# Altium schematic sheet J2_RefClkAndRTC.SchDoc
size A4; Organization: UltraZohm; SheetNumber: 5
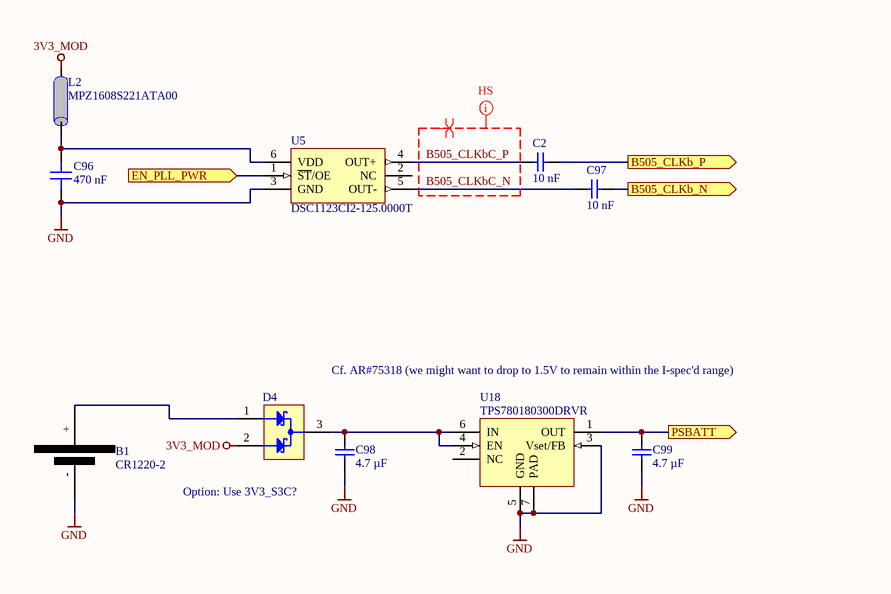
[diagram p0: J2_RefClkAndRTC.SchDoc]

## Parts
B1  CR1220-2  [CR1220]
C2  10 nF  [C_0402_TE]
C96  470 nF  [C_0603_TE]
C97  10 nF  [C_0402_TE]
C98  4.7 µF  [C_0603_TE]
C99  4.7 µF  [C_0603_TE]
D4  BAT54CT-7-F  [SOT523-3]  (value not drawn)
L2  MPZ1608S221ATA00  [RES 0603_1608]
U5  DSC1123CI2-125.0000T  [PSON105P320X250X90-6N]
U18  TPS780180300DRVR  [SON65P200X200X80-7N]

## Ports
B505_CLKb_N (out), B505_CLKb_P (out), EN_PLL_PWR (in), PSBATT (out)

## Nets
3V3_MOD: D4.2(A) L2.1
GND: B1.- C96.1 C98.1 C99.1 U5.3(GND) U18.3(Vset/FB) U18.5(GND) U18.7(PAD)
B505_CLKb_N: C97.2 ; port B505_CLKb_N
B505_CLKb_P: C2.2 ; port B505_CLKb_P
B505_CLKbC_N: C97.1 U5.5(OUT-)
B505_CLKbC_P: C2.1 U5.4(OUT+)
EN_PLL_PWR: U5.1(~{ST}/OE) ; port EN_PLL_PWR
PSBATT: C99.2 U18.1(OUT) ; port PSBATT
NetB1_+: B1.+ D4.1(A)
NetC96_2: C96.2 L2.2 U5.6(VDD)
NetC98_2: C98.2 D4.3(K) U18.4(EN) U18.6(IN)

Not connected (* = marked no-connect by the designer): U5 2(NC); U18 2(NC)

## Layout directives
differential pair: B505_CLKbC_N, B505_CLKbC_P
net class HS: B505_CLKbC_N, B505_CLKbC_P

## Notes on the sheet
- Cf. AR#75318 (we might want to drop to 1.5V to remain within the I-spec'd range)
- Option: Use 3V3_S3C?
- Title
- Revision:
- Design Engineer:
- Date:
- Project:
- Sheet
- of

## Library data of the parts
B1 = CR1220-2: Battery base CR1220 SMD Button And Strip Battery Connector ROHS; Manufacturer: Q&J; Created from: FRosner; Manufacturer Part Number: CR1220-2; PartID: 36; Created On: 02/07/2024 19:17:25; ComponentLink1Description: Datasheet; ComponentLink1URL: https://wmsc.lcsc.com/wmsc/upload/file/pdf/v2/lcsc/2405081637_Q-J-CR1220-2_C70381.pdf; Component Type: Battery holder; Device Package: SMD; Last Updated: 23/08/2024 11:42:29; Mounting Type: SMD; Operating Temperature: -40 to +85 °C; Supplier 1: LCSC; Supplier Part Number 1: C70381; Type: Battery holder; Live Cycle Status: 1; LCSC Part Number: C70381; Stock number: not stored
C2 C97 = UZgen_C_0402_10nF_16V_X7R: Generic capacitor; Manufacturer: UZgen; Voltage: 16V; Tolerance: 10 %; Created from: UZgenTool; Technology: X7R; Value: 10 nF; Manufacturer Part Number: UZgen_C_0402_10nF_16V_X7R; PartID: 2900; Created On: 02/08/2024 11:17:39; Device Package: 0402; Mounting Type: SMD; Last Updated: 02/08/2024 11:17:39
C96 = CL10A474KB8NNNC: Capacitor 0603, 50 VDC, 470 nF, X5R; Manufacturer: Samsung Electro-Mechanics; Tolerance: 10 %; Voltage Rating: 50 VDC; Created from: AGeiger; Value: 470 nF; Manufacturer Part Number: CL10A474KB8NNNC; PartID: 103; Created On: 22/08/2022 14:44:45; ComponentLink1Description: Datasheet; ComponentLink1URL: https://datasheet.lcsc.com/lcsc/1810191213_Samsung-Electro-Mechanics-CL10A474KB8NNNC_C170149.pdf; Component Type: Capacitor 0603; Device Package: 0603; Last Updated: 22/04/2025 15:48:45; Mounting Type: SMD; Operating Temperature: -55 - 85°C; Series: X5R; Supplier 1: LCSC; Supplier Part Number 1: C170149; Supplier 2: Mouser; Supplier Part Number 2: 187-CL10A474KB8NNNC; Type: Capacitor; Live Cycle Status: 1; LCSC Part Number: C170149
C98 C99 = UZgen_C_0603_4.7uF_16V_X5R: Generic capacitor; Manufacturer: UZgen; Voltage: 16V; Tolerance: 10 %; Created from: MGeier; Manufacturer Part Number: UZgen_C_0603_4.7uF_16V_X5R; PartID: 5809; Created On: 20/03/2025 14:43:45; Value: 4.7 µF; Device Package: 0603; Technology: X5R; Mounting Type: SMD; Last Updated: 20/03/2025 14:43:45
D4 = BAT54CT-7-F: Surface-mount Schottky Barrier Diode, 1 Pair Common Cathode 1V@100mA 200mA 2uA@25V 30V SOT-523-3; Manufacturer: Diodes Incorporated; Type: Schottky Diode; Forward Current: 1 mA; Forward Voltage: 320 mV; Reverse Current: 2 µA; Created from: MGeier; Manufacturer Part Number: BAT54CT-7-F; PartID: 28; Created On: 19/07/2025 15:30:00; ComponentLink1Description: Datasheet; ComponentLink1URL: https://www.diodes.com/datasheet/download/BAT54T.pdf; Component Type: Schottky Diode; Device Package: SOT-523-3; Last Updated: 21/07/2025 13:11:15; Mounting Type: SMD; Operating Temperature: -65 to +150 °C; Series: BAT54T/AT/CT/ST; Supplier 1: LCSC; Supplier Part Number 1: C134407; Value: 30 V; Live Cycle Status: 1; LCSC Part Number: C134407; Stock number: not stored; ComponentLink2Description: Homepage; ComponentLink2URL: https://www.diodes.com/part/view/BAT54CT
L2 = MPZ1608S221ATA00: Ferritperle, 0603, 220 ohm, 2.2 A, Baureihe MPZ, 0.05 ohm, ± 25%; Manufacturer: TDK; Value: 220 Ohm; Type: Ferrite; DC current: 2.2 A; Created from: MGremer; Manufacturer Part Number: MPZ1608S221ATA00; PartID: 3; Created On: 08/06/2021 11:33:39; ComponentLink1Description: Datasheet; ComponentLink1URL: http://www.farnell.com/datasheets/2291439.pdf; Component Type: Ferritperle; Device Package: 0603; Last Updated: 12/07/2024 17:26:54; Mounting Type: SMD; Operating Temperature: -55 - 125 °C; Series: MPZ; Supplier 1: Farnell; Supplier Part Number 1: 1301677RL; Live Cycle Status: 1; LCSC Part Number: C76815; Stock number: not stored
U5 = DSC1123CI2-125.0000T: Standard Clock Oscillators MEMS OSC, LVDS, 125MHz, 25PPM, 2.5-3.3V, -40 to 85C, 3.2 x 2.5mm; Manufacturer: Microchip; Created from: FRosner; Manufacturer Part Number: DSC1123CI2-125.0000T; PartID: 8; Created On: 30/07/2024 09:44:11; ComponentLink1Description: Datasheet; ComponentLink1URL: https://www.mouser.de/datasheet/2/268/DSC1103_23_Low_Jitter_Precision_LVDS_Oscillator_DS-3314614.pdf; Component Type: LVDS; Device Package: VDFN-6; Last Updated: 30/07/2024 09:44:11; Mounting Type: SMD; Operating Temperature: -40°C - 85°C; Series: DSC1123; Supplier 1: Mouser; Supplier Part Number 1: 998-1123CI2125.0000T; Supplier 2: LCSC; Supplier Part Number 2: C1987227; Value: DSC1123CI2-125.0000T; LCSC Part Number: C1987227
U18 = TPS780180300DRVR: LDO Voltage Regulators 150mA,LDO Reg,Ultra Low Pwr; Manufacturer: Texas Instruments; Value: 1.8 V, 3 V; Created from: FRosner; Manufacturer Part Number: TPS780180300DRVR; PartID: 17; Created On: 02/07/2024 16:16:00; ComponentLink1Description: Datasheet; ComponentLink1URL: https://wmsc.lcsc.com/wmsc/upload/file/pdf/v2/lcsc/2302220830_Texas-Instruments-TPS780180300DRVR_C2860011.pdf; Component Type: LDO; Device Package: SMD; Last Updated: 03/09/2024 16:21:15; Mounting Type: SMD; Operating Temperature: -40 to +125 °C; Series: TPS780; Supplier 1: Mouser; Supplier Part Number 1: 595-TPS780180300DRVR; Supplier 2: LCSC; Supplier Part Number 2: C2860011; Type: LDO; Live Cycle Status: 1; LCSC Part Number: C2860011; Stock number: not stored